# EAGLE design ZeroBug MK2 REV1 (EAGLE 7.7.0)
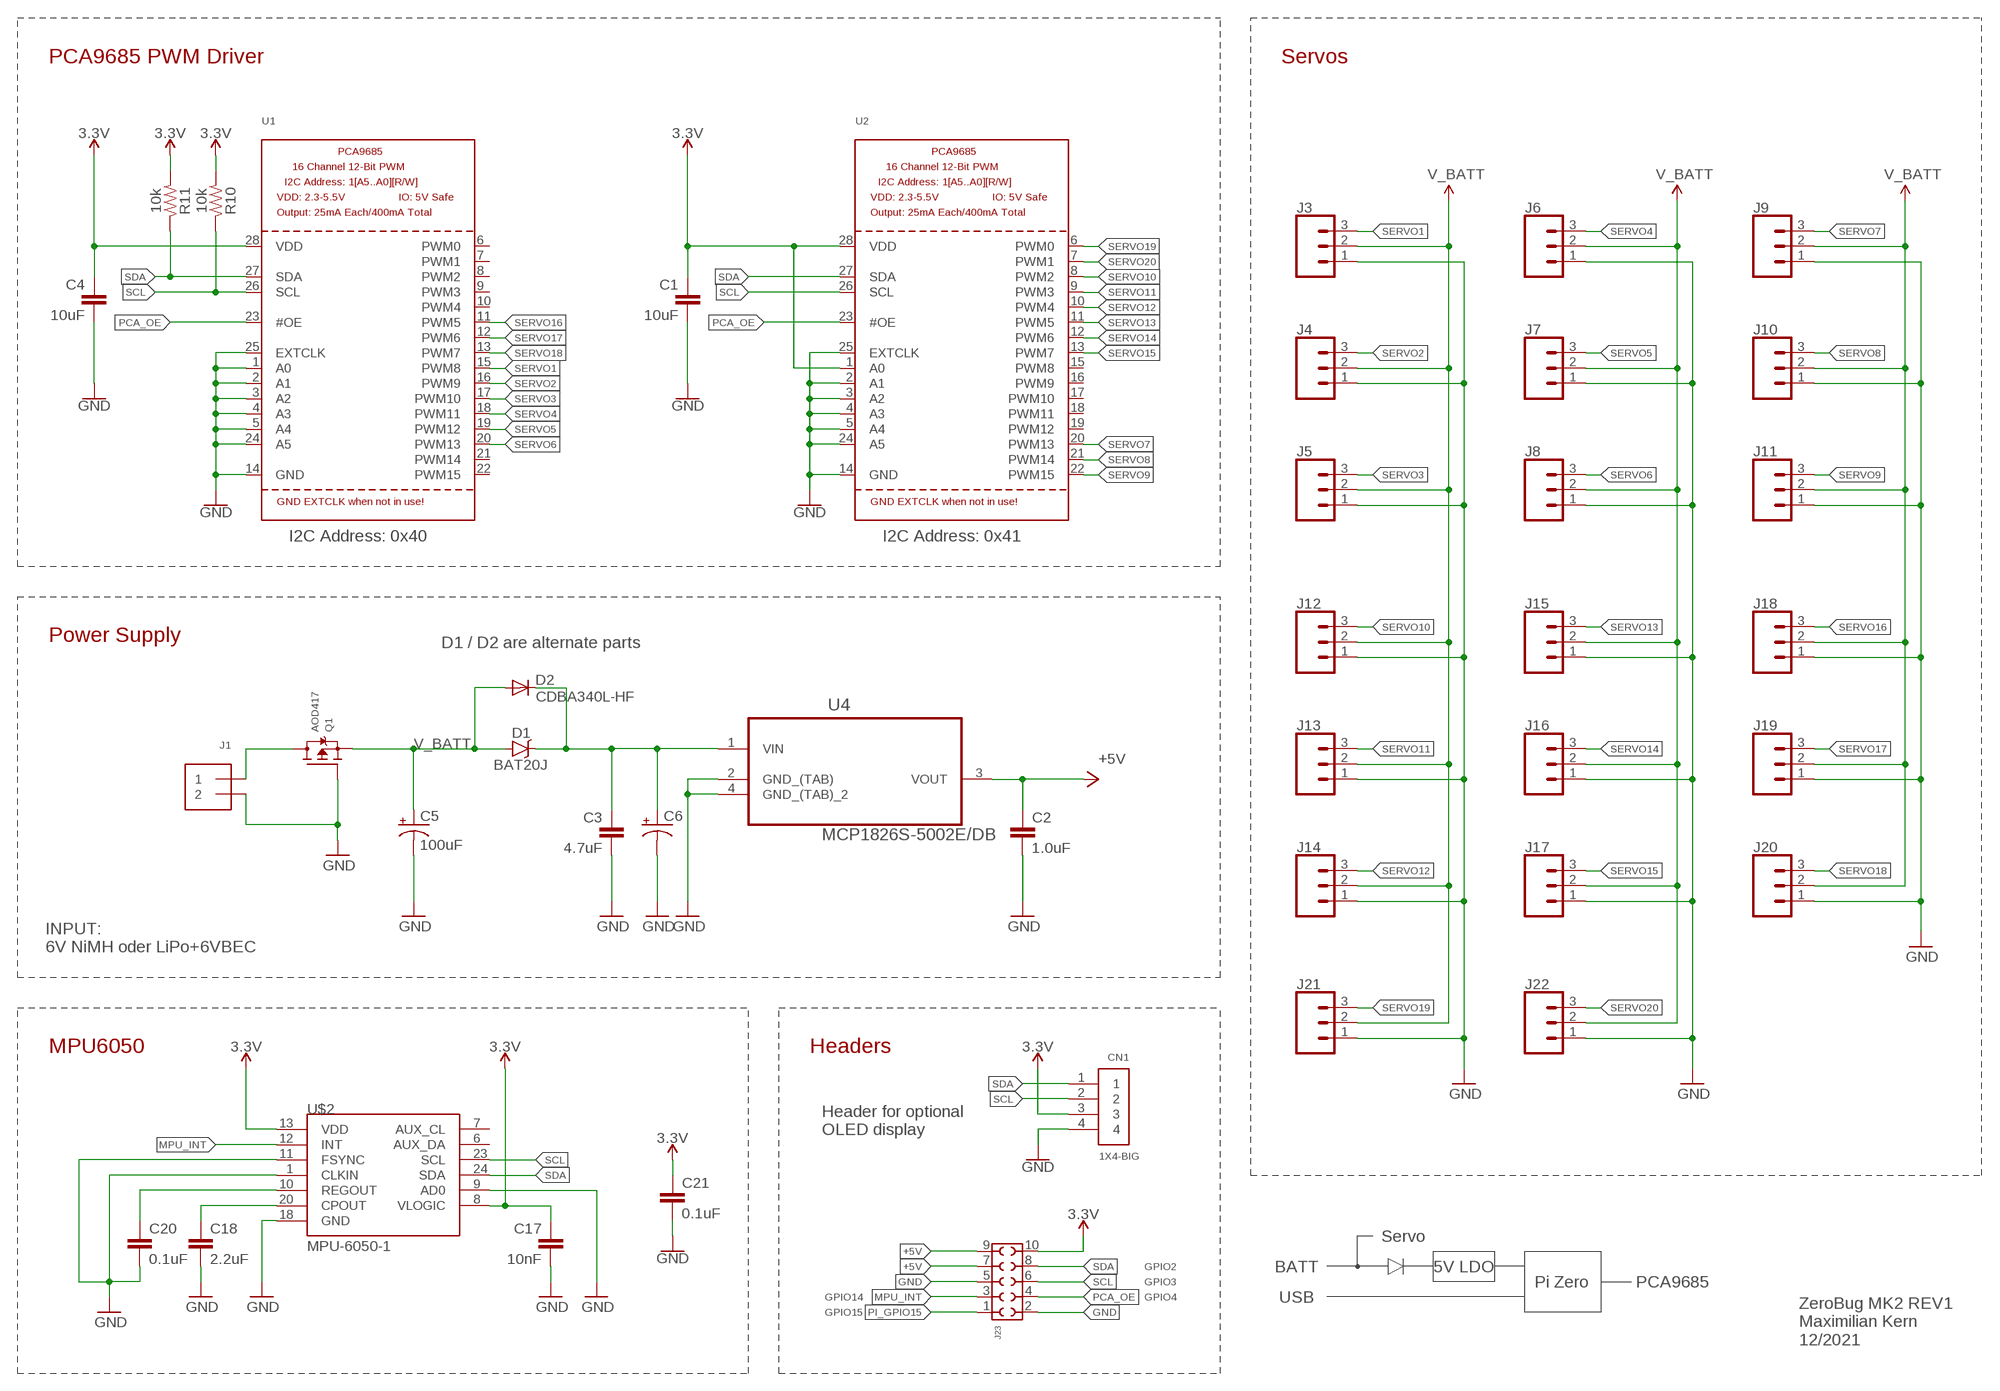
[diagram p0: schematic, sheet 1]

## Parts
C1  10uF  1.0UF-0805-25V-(+80/-20%)  [0805]
C2  1.0uF  1.0UF-0805-25V-(+80/-20%)  [0805]
C3  4.7uF  1.0UF-0805-25V-(+80/-20%)  [0805]
C4  10uF  1.0UF-0805-25V-(+80/-20%)  [0805]
C5  100uF  100UF-POLAR-25V-20%(ELEC)  [PANASONIC_D]
C6  CPOL-USE5-10.5  [E5-10,5]
C17  10nF  47PF-0603-50V-5%  [0603]
C18  2.2uF  1.0UF-0805-25V-(+80/-20%)  [0805]
C20  0.1uF  0.1UF-0603-25V-(+80/-20%)  [0603]
C21  0.1uF  0.1UF-0603-25V-(+80/-20%)  [0603]
CN1  1X4-BIG  [1X04-BIG]
D1  BAT20J  DIODE-SCHOTTKY-BAT20J  [SOD-323]
D2  CDBA340L-HF  DIODE-DO-214AC  [DO-214AC]
J1  TERMBLOCK_1X2  [TERMBLOCK_1X2-3.5MM]
J3  CONN_03  [1X03]
J4  CONN_03  [1X03]
J5  CONN_03  [1X03]
J6  CONN_03  [1X03]
J7  CONN_03  [1X03]
J8  CONN_03  [1X03]
J9  CONN_03  [1X03]
J10  CONN_03  [1X03]
J11  CONN_03  [1X03]
J12  CONN_03  [1X03]
J13  CONN_03  [1X03]
J14  CONN_03  [1X03]
J15  CONN_03  [1X03]
J16  CONN_03  [1X03]
J17  CONN_03  [1X03]
J18  CONN_03  [1X03]
J19  CONN_03  [1X03]
J20  CONN_03  [1X03]
J21  CONN_03  [1X03]
J22  CONN_03  [1X03]
J23  6103XX21821_61031021821  [61031021821]
Q1  AOD417  MOSFET-PTO252  [TO252]
R10  10k  10KOHM-0603-1/10W-1%  [0603]
R11  10k  10KOHM-0603-1/10W-1%  [0603]
U1  PCA9685  [TSSOP28]
U2  PCA9685  [TSSOP28]
U4  MCP1826S-5002E/DB  MCP1825S-5002E/DB  [SOT230P700X180-4N]
U$2  MPU-6050-1  [QFN-24-4MM2]

## Nets
3.3V: C1.1 C4.1 C17.1 C21.1 CN1.3 J23.10 R10.2 R11.2 U1.28(VDD) U2.1(A0) U2.28(VDD) U$2.8(VLOGIC) U$2.13(VDD)
+5V: C2.1 J23.7 J23.9 U4.3(VOUT)
GND: C1.2 C2.2 C3.2 C4.2 C5.- C6.- C17.2 C18.2 C20.2 C21.2 CN1.4 J1.2 J3.1 J4.1 J5.1 J6.1 J7.1 J8.1 J9.1 J10.1 J11.1 J12.1 J13.1 J14.1 J15.1 J16.1 J17.1 J18.1 J19.1 J20.1 J21.1 J22.1 J23.2 J23.5 Q1.1(G) U1.1(A0) U1.2(A1) U1.3(A2) U1.4(A3) U1.5(A4) U1.14(GND) U1.24(A5) U1.25(EXTCLK) U2.2(A1) U2.3(A2) U2.4(A3) U2.5(A4) U2.14(GND) U2.24(A5) U2.25(EXTCLK) U4.2(GND_(TAB)) U4.4(GND_(TAB)_2) U$2.1(CLKIN) U$2.9(AD0) U$2.11(FSYNC) U$2.18(GND)
MPU_INT: J23.3 U$2.12(INT)
N$4: C3.1 C6.+ D1.C D2.C U4.1(VIN)
N$6: J1.1 Q1.3(D)
N$17: C18.1 U$2.20(CPOUT)
N$18: C20.1 U$2.10(REGOUT)
PCA_OE: J23.4 U1.23(#OE) U2.23(#OE)
PI_GPIO15: J23.1
SCL: CN1.2 J23.6 R10.1 U1.26(SCL) U2.26(SCL) U$2.23(SCL)
SDA: CN1.1 J23.8 R11.1 U1.27(SDA) U2.27(SDA) U$2.24(SDA)
SERVO1: J3.3 U1.15(PWM8)
SERVO2: J4.3 U1.16(PWM9)
SERVO3: J5.3 U1.17(PWM10)
SERVO4: J6.3 U1.18(PWM11)
SERVO5: J7.3 U1.19(PWM12)
SERVO6: J8.3 U1.20(PWM13)
SERVO7: J9.3 U2.20(PWM13)
SERVO8: J10.3 U2.21(PWM14)
SERVO9: J11.3 U2.22(PWM15)
SERVO10: J12.3 U2.8(PWM2)
SERVO11: J13.3 U2.9(PWM3)
SERVO12: J14.3 U2.10(PWM4)
SERVO13: J15.3 U2.11(PWM5)
SERVO14: J16.3 U2.12(PWM6)
SERVO15: J17.3 U2.13(PWM7)
SERVO16: J18.3 U1.11(PWM5)
SERVO17: J19.3 U1.12(PWM6)
SERVO18: J20.3 U1.13(PWM7)
SERVO19: J21.3 U2.6(PWM0)
SERVO20: J22.3 U2.7(PWM1)
V_BATT: C5.+ D1.A D2.A J3.2 J4.2 J5.2 J6.2 J7.2 J8.2 J9.2 J10.2 J11.2 J12.2 J13.2 J14.2 J15.2 J16.2 J17.2 J18.2 J19.2 J20.2 J21.2 J22.2 Q1.2(S)
Unconnected: U1.6(PWM0) U1.7(PWM1) U1.8(PWM2) U1.9(PWM3) U1.10(PWM4) U1.21(PWM14) U1.22(PWM15) U2.15(PWM8) U2.16(PWM9) U2.17(PWM10) U2.18(PWM11) U2.19(PWM12) U$2.6(AUX_DA) U$2.7(AUX_CL)

## Notes on the sheet
- PCA9685 PWM Driver | Servos
- I2C Address: 0x40 | I2C Address: 0x41
- Power Supply
- D1 / D2 are alternate parts
- INPUT:
  6V NiMH oder LiPo+6VBEC
- MPU6050 | Headers
- Header for optional
  OLED display
- Servo
- GPIO2 | BATT | 5V LDO
- GPIO3 | Pi Zero | PCA9685
- GPIO14 | GPIO4 | USB
- ZeroBug MK2 REV1
  Maximilian Kern
  12/2021
- GPIO15

## Library data of the parts
C1 C3 C4 C18 = SparkFun-Capacitors:1.0UF: 1µF ceramic capacitors A capacitor is a passive two-terminal electrical component used to store electrical energy temporarily in an electric field.; PROD_ID: CAP-11625; VALUE: 1.0uF
C2 = SparkFun-Capacitors:1.0UF: 1µF ceramic capacitors A capacitor is a passive two-terminal electrical component used to store electrical energy temporarily in an electric field.; PROD_ID: CAP-11625
C5 = SparkFun-Capacitors:100UF-POLAR: 100µF polarized capacitors A capacitor is a passive two-terminal electrical component used to store electrical energy temporarily in an electric field.; PROD_ID: CAP-12547
C6 = adafruit:CPOL-US: POLARIZED CAPACITOR, American symbol
C17 = SparkFun-Capacitors:47PF: 47pF ceramic capacitors A capacitor is a passive two-terminal electrical component used to store electrical energy temporarily in an electric field.; PROD_ID: CAP-08913; VALUE: 47pF
C20 C21 = SparkFun-Capacitors:0.1UF: 0.1µF ceramic capacitors A capacitor is a passive two-terminal electrical component used to store electrical energy temporarily in an electric field.; PROD_ID: CAP-00810
CN1 = adafruit:1X4: 4-pin connector
D1 = SparkFun-DiscreteSemi:DIODE-SCHOTTKY: Schottky diodes in SFE's production catalog BAT20J 1A 23V 0.62Vf RB751 120mA 40V 0.37Vf PMEG4005EJ 0.5A 40V 0.42Vf MBRA140 1A 40V 0.5Vf B340A 3A 40V SMA; PROD_ID: DIO-11623
D2 = diode:DIODE-: DIODE
J1 = microbuilder:TERMBLOCK_1X2: 3.5mm Terminal block http://www.ladyada.net/library/pcb/eaglelibrary.html
J3-J22 = SparkFun-Connectors:CONN_03: Multi connection point. Often used as Generic Header-pin footprint for 0.1 inch spaced/style header connections On any of the 0.1 inch spaced packages, you can populate with these: Break Away Headers - Straight <https://www.sparkfun.com/products/116> (PRT-00116) Break Away Male Headers - Right Angle <https://www.sparkfun.com/products/553> (PRT-00553) Female Headers <https://www.sparkfun.com/products/115> (PRT-00115) Break Away Headers - Machine Pin <https://www.sparkfun.com/products/117> (PRT-00117) Break Away Female Headers - Swiss Machine Pin <https://www.sparkfun.com/products/743> (PRT-00743) Stackable Header - 3 Pin (Female, 0.1") <https://www.sparkfun.com/products/13875> (PRT-13875) For SCREWTERMINALS and SPRING TERMINALS visit here: Screw Terimnals on SparkFun.com <https://www.sparkfun.com/search/results?term=Screw+Terminals> (5mm/3.5mm/2.54mm spacing) This device is also useful as a general connection point to wire up your design to another part of your project. Our various solder wires solder well into these plated through hole pads. Hook-Up Wire - Assortment (Stranded, 22 AWG) <https://www.sparkfun.com/products/11375> (PRT-11375) Hook-Up Wire - Assortment (Solid Core, 22 AWG) <https://www.sparkfun.com/products/11367> (PRT-11367) View the entire wire category on our website here <https://www.sparkfun.com/categories/141> Special notes: Molex polarized connector foot print use with SKU : PRT-08232 with associated crimp pins and housings.; PROD_ID: XXX-00000; VALUE: 455-1750-1-ND
J23 = Eagle_WR-PHD (rev19a):6103XX21821_61031021821: WR-PHD 2.54 mm SMT Dual Socket Header (Reel) ARTICLE PROPERTIES Pins ： 4;​ 6;​ 8;​ 10;​ 12;​ 14;​ 16;​ 18;​ 20;​ 22;​ 24;​ 26 KIND PROPERTIES Pitch 2.54 mm Quality Class 3 as per CECC 75 301-802 Rows Dual Gender Socket Header Type Straight Type 2 MATERIAL PROPERTIES Insulator Material PA46 Insulator Flammability Rating UL94 V-0 Contact Material Copper Alloy Contact Plating Gold Contact Type Stamped GENERAL INFORMATION Operating Temperature -40 up to +105 °C ELECTRICAL PROPERTIES Rated Current 3 A IR1 = 3A Withstanding Voltage 600 V (AC) Contact Resistance 20 mΩ RISO 1000 MΩ CERTIFICATION UL Approval E323964 PACKAGING PROPERTIES Packaging Tape and Reel with Cap <https://katalog.we-online.com/media/images/v2/o33206v209%20Family_WR-PHD_610xxx21821.jpg> Details see: https://katalog.we-online.com/en/em/PHD_2_54_SMT_DUAL_SOCKET_HEADER_REEL_6103XX21821 Updated by Ella Wu 2019-06-12 2019 (C) Würth Elektronik; DATASHEET-URL: https://katalog.we-online.com/em/datasheet/61031021821.pdf; GENDER: Socket Header; IR: 3A; PACKAGING: Tape and Reel with Cap; PART-NUMBER: 61031021821; PINS: 10; ROWS: Dual; TYPE: Straight Type 2; WE-NUMBER: 61031021821
Q1 = microbuilder:MOSFET-P: P-Channel Mosfet LEGEND VDS: Voltage Drain-Source ID: Drain Current RDS(ON): Drain-Source On-State Resistance VGS(TH): Gate-Source Threshold Voltage CISS: Drain-Source Input Capacitance SOT-23 Name VDS ID RDS(ON) VGS(TH) CISS Order Number IRLML5103 30V 760mA 600 mOhm -- 75pF @ 25V Digikey: IRLML5103PBFCT-ND IRLML6401 12V 4.3A 50 mOhm 950mV @ 250µA 830pF @ 10V Digikey: IRLML6401PBFTR-ND NTR0202PL 20V 400mA 800 mOhm 2.3V @ 250uA 70pF @ 5V Digikey: NTR0202PLT1GOSTR-ND NTR4101PT1G 20V 1.8A 85 mOhm 1.2V @ 250uA 675pF @ 10V Digikey: NTR4101PT1GOSCT-ND DMP2004K 20V 600mA 900 mOhm 1V @ 250uA 175pF @ 16V Digikey: DMP2004KDICT-ND PMV65XP 20V 3.9A 76 mOhm 950mV @ 1mA 725pF @ 20V Digikey: 568-2358-2-ND TO-252 Name VDS ID RDS(ON) VGS(TH) CISS Order Number AOD417 30V 25A 34 mOhm 3V @ 250µA 920pF @ 15V Digikey: 785-1106-2-ND
R10 R11 = SparkFun-Resistors:10KOHM: 10kΩ resistor A resistor is a passive two-terminal electrical component that implements electrical resistance as a circuit element. Resistors act to reduce current flow, and, at the same time, act to lower voltage levels within circuits. - Wikipedia; PROD_ID: RES-00824
U1 U2 = adafruit:PCA9685: PCA9685 - 16 Channel 12-Bit I2C PWM Controller 5.0V tolerant 16 channel, 12-bit I2C PWM controller with 25mA per output (max. 400mA total) Digikey: 568-5931-1-ND
U4 = Microchip_By_element14_Batch_1:MCP1825S-5002E/DB: IC, LDO, 5.0V, 500MA; MPN: MCP1825S-5002E/DB; OC_FARNELL: 1578407; OC_NEWARK: 26M9964; PACKAGE: SOT-223-3; SUPPLIER: Microchip
U$2 = MPU-6050 hand solder:MPU-6050

## Board
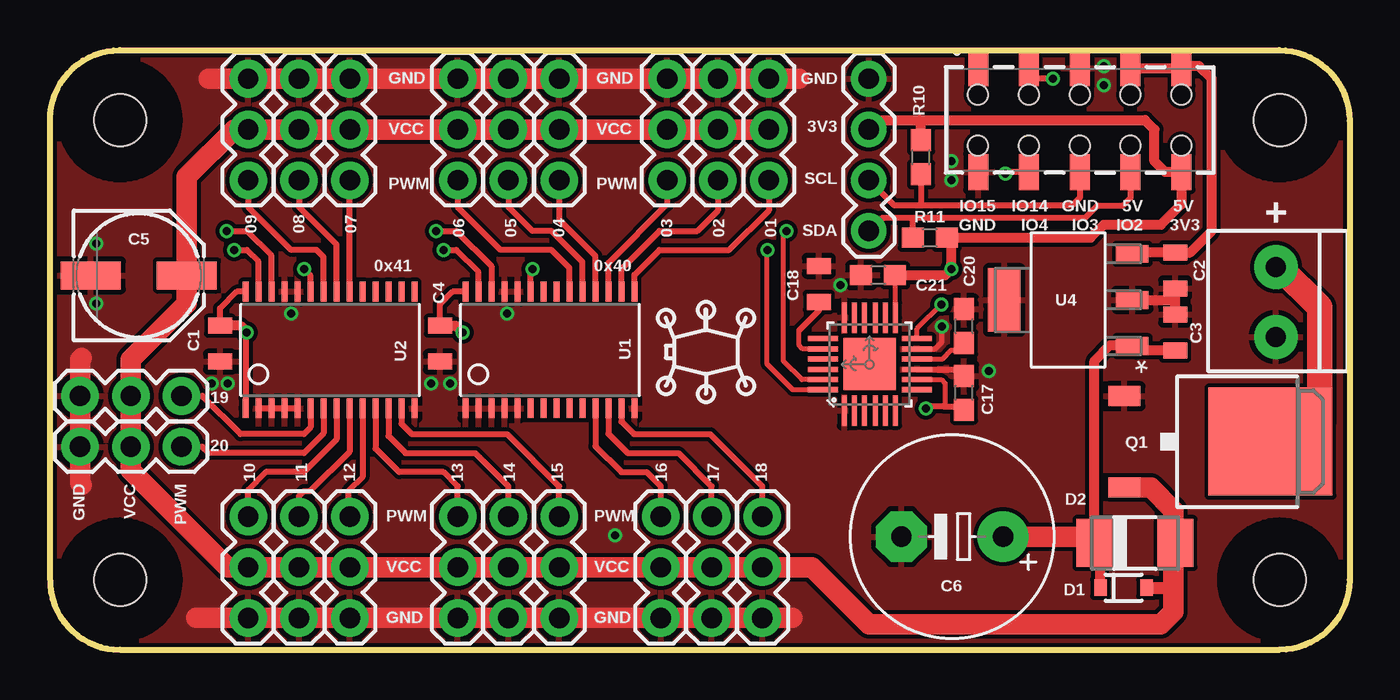
[diagram p1: board, top side]
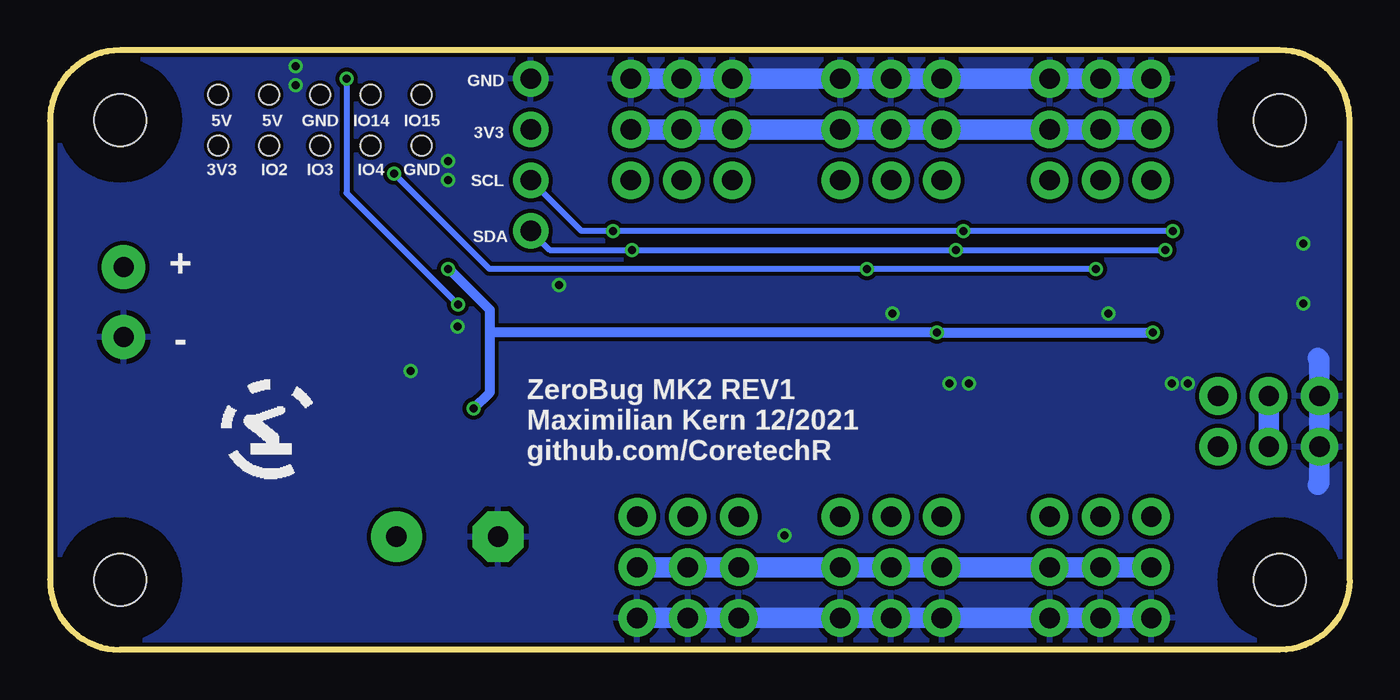
[diagram p2: board, bottom side, seen from below]

Size 65 x 30 mm. Coordinates in mm from the lower left corner, seen from the top.
Outline: 0,3.5 0,26.5 arc-90 3.5,30 61.46,30 arc-90 65,26.46 65,3.5 arc-90 61.5,0 3.5,0 arc-90 0,3.5
Copper layers (1*16): Top 0.035mm / dielectric 1.5mm / Bottom 0.035mm
Design rules "aisler_2_layer *": minimum track width 0.2mm, minimum drill 0.2mm, track to track 0.2mm, track to pad 0.2mm, pad to pad 0.2mm, via to via 0.2mm, smd to smd 0.1mm, copper to edge 0.2mm, drill to drill 0.21mm, minimum pad ring 0.25mm, minimum via ring 0.15mm, stop-mask expansion 2.5mil, vias tented up to drill 43mil, thermal gap 10mil
Holes 2.6 mm at 61.5,26.5 3.5,26.5 3.5,3.5 61.5,3.5
Holes 1 mm at 46.42,27.77 48.96,27.77 51.5,27.77 54.04,27.77 56.58,27.77 56.58,25.23 54.04,25.23 51.5,25.23 48.96,25.23 46.42,25.23

### Footprints (pad centres in the part's own frame; a part is rotated, then mirrored left to right if it is on the bottom)
0805 = smd 0.8 x 1.2: 1 -0.9,0; 2 0.9,0
PANASONIC_D = smd 3 x 1.4: + 2.4,0; - -2.4,0
E5-10,5 = drill 1.016 pad 2.54: + -2.54,0 | drill 1.016 pad 2.54 octagon: - 2.54,0
0603 = smd 1.1 x 1: 1 -0.85,0; 2 0.85,0
1X04-BIG = drill 1.016 pad 1.778: 1 0,0; 2 2.54,0; 3 5.08,0; 4 7.62,0
SOD-323 = smd 0.63 x 0.83: A 1.15,0; C -1.15,0
DO-214AC = smd 1.8 x 2.4: A 2.025,0; C -2.025,0
TERMBLOCK_1X2-3.5MM = drill 1 pad 2.184: 1 1.8,0; 2 -1.7,0
1X03 = drill 1.016 pad 1.88: 1 0,0; 2 2.54,0; 3 5.08,0
61031021821 = smd 1 x 1.8: 1 -5.08,2.6; 2 -5.08,-2.6; 3 -2.54,2.6; 4 -2.54,-2.6; 5 0,2.6; 6 0,-2.6; 7 2.54,2.6; 8 2.54,-2.6; 9 5.08,2.6; 10 5.08,-2.6
TO252 = smd 1 x 1.6: 1 -2.28,-4.8; 2 2.28,-4.8 | smd 5.4 x 6.2: 3 0,2.5
TSSOP28 = smd 0.305 x 0.991: 1 -4.225,-2.918; 2 -3.575,-2.918; 3 -2.925,-2.918; 4 -2.275,-2.918; 5 -1.625,-2.918; 6 -0.975,-2.918; 7 -0.325,-2.918; 8 0.325,-2.918; 9 0.975,-2.918; 10 1.625,-2.918; 11 2.275,-2.918; 12 2.925,-2.918; 13 3.575,-2.918; 14 4.225,-2.918; 15 4.225,2.918; 16 3.575,2.918; 17 2.925,2.918; 18 2.275,2.918; 19 1.625,2.918; 20 0.975,2.918; 21 0.325,2.918; 22 -0.325,2.918; 23 -0.975,2.918; 24 -1.625,2.918; 25 -2.275,2.918; 26 -2.925,2.918; 27 -3.575,2.918; 28 -4.225,2.918
SOT230P700X180-4N = smd 1.626 x 0.889: 1 -3.2,2.311; 2 -3.2,0; 3 -3.2,-2.311 | smd 1.626 x 3.175: 4 3.2,0
QFN-24-4MM2 = smd 1.516 x 0.254: 1 -2.316,1.257; 2 -2.316,0.75; 3 -2.316,0.247; 4 -2.316,-0.287; 5 -2.316,-0.792; 6 -2.316,-1.297; 13 2.336,-1.297; 14 2.336,-0.792; 15 2.336,-0.287; 16 2.336,0.247; 17 2.336,0.75; 18 2.336,1.257 | smd 0.254 x 1.516: 7 -1.267,-2.372; 8 -0.762,-2.372; 9 -0.258,-2.372; 10 0.278,-2.372; 11 0.78,-2.372; 12 1.287,-2.372; 19 1.287,2.332; 20 0.78,2.332; 21 0.278,2.332; 22 -0.258,2.332; 23 -0.762,2.332; 24 -1.267,2.332 | smd 2.616 x 2.616: P$1 0.02,-0.01

### Placement (x,y rotation side)
C1  8.51,15.32 270 top
C2  56.28,18.98 270 top
C3  56.28,15.86 90 top
C4  19.51,15.32 270 top
C5  4.45,18.73 0 top
C6  45.13,5.66 180 top
C17  45.72,12.86 90 top
C18  38.45,18.31 90 top
C20  45.72,16.19 90 top
C21  41.42,18.74 180 top
CN1  40.96,20.95 90 top
D1  53.7,3.11 0 top
D2  54.26,5.34 0 top
J1  61.32,17.35 90 top
J3  35.95,28.57 270 top
J4  33.41,28.57 270 top
J5  30.87,28.57 270 top
J6  25.47,28.57 270 top
J7  22.93,28.57 270 top
J8  20.39,28.57 270 top
J9  14.99,28.57 270 top
J10  12.46,28.57 270 top
J11  9.91,28.57 270 top
J12  9.91,1.59 90 top
J13  12.46,1.59 90 top
J14  14.99,1.59 90 top
J15  20.39,1.59 90 top
J16  22.93,1.59 90 top
J17  25.47,1.59 90 top
J18  30.55,1.59 90 top
J19  33.09,1.59 90 top
J20  35.63,1.59 90 top
J21  1.5,12.7 0 top
J22  1.5,10.16 0 top
J23  51.51,26.51 0 top
Q1  58.55,10.41 270 top
R10  43.56,24.64 90 top
R11  44.01,20.61 0 top
U1  25.01,15 0 top
U2  14.01,15 0 top
U4  50.93,17.5 180 top
U$2  40.99,14.28 90 top

### Tracks (layer width: path | path; a pad name or v marks a point on that pad's centre or on a via)
3.3V  (via drill 0.4)
  Top 0.25: U$2.8 44.59,13.52 44.77,13.34 44.77,12.13 44.73,12.17 | U$2.13 42.29,18.72 C21.1
  Top 0.3: v43.81,12.06 43.92,12.17 44.73,12.17 45.56,12.17 C17.1 | 9.78,15.94 v9.84,15.88 9.78,15.81 U2.1 | U1.28 20.14,17.92 19.51,17.29 C4.1 | C1.1 8.51,17.08 9.35,17.92 U2.28 | 43.56,26.45 43.5,26.51
  Top 0.5: v9.84,15.88 9.5,16.22 C1.1 | C4.1 20.3,16.22 v20.64,15.88 | CN1.3 41.43,26.51 43.5,26.51 54.77,26.51 55.24,26.04 55.24,24.45 55.78,23.91 J23.10 56.59,22.3 55.56,21.27 52.7,21.27 52.05,20.61 R11.2 45.09,20.38 v45.09,19.05 44.78,18.74 C21.1 | R10.2 43.56,26.45
  Bottom 0.5: v9.84,15.88 v20.64,15.88 42.96,15.88 43,15.83 | v43.81,12.06 43,12.88 43,15.83 | 43,15.83 43,17 45.05,19.05 v45.09,19.05
+5V
  Top 0.3: 54.2,19.88 U4.3
  Top 0.5: 54.2,19.88 C2.1 57.03,19.88 58.1,20.95 58.1,28.57 57.47,29.21 56.69,29.21 J23.9 J23.7
GND  (via drill 0.4)
  Top 0.25: U$2.11 44.27,15.06 44.61,15.4 v44.61,16.16 v44.61,16.17
  Top 0.3: 56.24,17.5 56.28,17.46 | U2.5 U2.4 U2.3 U2.2 | U$2.9 45.41,14.02 C17.2
  Top 0.5: C3.2 56.28,17.46 C2.2 | U4.2 56.24,17.5
  Top 1.016: 7.3,1.59 J13.1 37.15,1.59 | 37.47,28.57 J11.1 7.94,28.57 | 1.59,14.61 1.5,14.52 J21.1 1.5,8.34 1.59,8.26
  Bottom 1.016: J12.1 35.88,1.59 | J11.1 35.88,28.57 | 1.59,14.61 1.5,14.52 J21.1 1.5,8.34 1.59,8.26
  other vias: 8.89,13.34 8.1,13.34 20,13.34 19.05,13.34 12.06,16.83 22.86,16.83 45.09,23.5 45.09,24.45 52.7,29.21 52.7,28.26 2.31,20.33 2.31,17.33 46.95,13.96 39.53,18.26 28.26,5.71
  pour Top: 0,30 0,0 65,0 65,30
  pour Bottom: 0,30 0,0 65,0 65,30
MPU_INT  (via drill 0.4)
  Top 0.25: v44.59,17.28 43.37,16.06 U$2.12
  Top 0.3: v50.16,28.57 49.08,28.57 49,28.5 49,29.08 J23.3
  Bottom 0.305: v50.16,28.57 50.16,22.86 v44.59,17.28
N$1
  cutout Bottom: 64.5,26.5 arc-90 61.5,23.5 arc-90 58.5,26.5 arc-90 61.5,29.5 arc-90
  cutout Bottom: 64.5,3.5 arc-90 61.5,0.5 arc-90 58.5,3.5 arc-90 61.5,6.5 arc-90
  cutout Bottom: 6.5,3.5 arc-90 3.5,0.5 arc-90 0.5,3.5 arc-90 3.5,6.5 arc-90
  cutout Bottom: 6.5,26.5 arc-90 3.5,23.5 arc-90 0.5,26.5 arc-90 3.5,29.5 arc-90
  cutout Top: 6.5,26.5 arc-90 3.5,23.5 arc-90 0.5,26.5 arc-90 3.5,29.5 arc-90
  cutout Top: 6.5,3.5 arc-90 3.5,0.5 arc-90 0.5,3.5 arc-90 3.5,6.5 arc-90
  cutout Top: 64.5,26.5 arc-90 61.5,23.5 arc-90 58.5,26.5 arc-90 61.5,29.5 arc-90
  cutout Top: 64.5,3.5 arc-90 61.5,0.5 arc-90 58.5,3.5 arc-90 61.5,6.5 arc-90
N$4
  Top 0.25: 51.8,5.66 51.92,5.66 D2.C
  Top 0.3: 54.36,14.96 U4.1 54.08,15.24
  Top 0.406: 52.55,5.03 D2.C
  Top 0.5: D1.C 52.55,5.03 | C3.1 54.36,14.96 | D2.C 52.24,14.46 53.02,15.24 54.08,15.24
  Top 1.016: 51.8,5.66 C6.+
N$6
  Top 1.27: J1.1 61.49,19.15 63.5,17.14 63.5,11.43 61.59,9.53 61.59,9.87 Q1.3
N$17
  Top 0.25: U$2.20 37.65,15.06 37.47,15.24 37.47,15.98
  Top 0.3: C18.1 38.45,16.97 37.47,15.98
N$18
  Top 0.25: U$2.10 44.65,14.55 45.09,14.99 45.37,14.99 C20.1 | 45.5,15 45.49,14.99 45.49,15.11 C20.1 | 45.62,15.24 C20.1
PCA_OE  (via drill 0.4)
  Top 0.3: J23.4 47.88,23.91 v47.78,23.81 | U1.23 24.03,18.95 v24.13,19.05 | U2.23 13.03,18.72 v12.7,19.05
  Bottom 0.3: v12.7,19.05 v24.13,19.05 43.02,19.05 v47.78,23.81
SCL  (via drill 0.4)
  Top 0.25: v36.83,20.95 36.69,20.82 36.69,14.43 37.6,13.52 U$2.23
  Top 0.3: J23.6 51.51,22.61 51.12,22.23 43.5,22.23 | U2.26 11.08,19.71 9.84,20.95 v8.84,20.95 | U1.26 22.08,19.19 20.32,20.95 v19.32,20.95 | 43.5,22.23 42.23,22.23 CN1.2 | R10.1 43.56,22.29 43.5,22.23
  Bottom 0.3: v8.84,20.95 v19.32,20.95 v36.83,20.95 38.42,20.95 CN1.2
SDA  (via drill 0.4)
  Top 0.25: v35.88,20 v35.87,20 35.87,14.29 37.15,13.01 U$2.24
  Top 0.3: 43.18,21.59 51.75,21.59 52.39,22.23 53.66,22.23 54.05,22.61 J23.8 | 43.18,21.59 41.59,21.59 CN1.1 | v19.68,20 20.32,20 21.43,18.89 U1.27 | v9.21,20 9.84,20 10.43,19.41 U2.27 | R11.1 43.16,21.57 43.18,21.59
  Bottom 0.3: CN1.1 40.01,20 v35.88,20 v19.68,20 v9.21,20
SERVO1
  Top 0.3: U1.15 29.23,18.75 30.48,20 33.97,20 35.95,21.98 J3.3
SERVO2
  Top 0.3: U1.16 28.58,19.06 30.48,20.95 32.38,20.95 33.41,21.98 J4.3
SERVO3
  Top 0.3: U1.17 27.93,19.36 30.87,22.3 J5.3
SERVO4
  Top 0.3: U1.18 27.28,19.71 25.47,21.52 J6.3
SERVO5
  Top 0.3: U1.19 26.63,19.41 25.08,20.95 24.13,20.95 22.93,22.15 J7.3
SERVO6
  Top 0.3: U1.20 25.98,19.1 25.08,20 22.54,20 20.39,22.15 J8.3
SERVO7
  Top 0.3: U2.20 J9.3
SERVO8
  Top 0.3: U2.21 14.33,20.27 12.46,22.15 J10.3
SERVO9
  Top 0.3: U2.22 13.68,19.66 13.34,20 12.06,20 9.91,22.15 J11.3
SERVO10
  Top 0.3: U2.8 14.33,10.52 12.7,8.89 10.79,8.89 9.91,8.01 J12.3
SERVO11
  Top 0.3: J13.3 12.46,7.69 12.7,7.94 13.02,7.94 14.98,9.9 U2.9
SERVO12
  Top 0.3: U2.10 15.63,8.65 14.92,7.94 14.92,6.74 J14.3
SERVO13
  Top 0.3: U2.11 16.28,10.07 17.46,8.89 19.68,8.89 20.39,8.18 J15.3
SERVO14
  Top 0.3: U2.12 16.93,10.69 17.78,9.84 21.27,9.84 22.93,8.18 J16.3
SERVO15
  Top 0.3: U2.13 17.58,11.31 18.1,10.79 22.86,10.79 25.47,8.18 J17.3
SERVO16
  Top 0.3: U1.11 27.28,10.18 28.57,8.89 29.84,8.89 30.55,8.18 J18.3
SERVO17
  Top 0.3: U1.12 27.93,10.8 28.89,9.84 31.43,9.84 33.09,8.18 J19.3
SERVO18
  Top 0.3: U1.13 28.58,11.42 29.21,10.79 33.02,10.79 35.63,8.18 J20.3
SERVO19
  Top 0.3: U2.6 13.03,11.13 12.7,10.79 9.53,10.79 7.62,12.7 J21.3
SERVO20
  Top 0.3: U2.7 13.68,10.82 12.7,9.84 7.94,9.84 7.62,10.16 J22.3
V_BATT
  Top 0.406: 56.13,3.11 56.2,3.17
  Top 0.61: D1.A 56.13,3.11
  Top 1.016: Q1.2 55.05,8.13 56.2,6.99 56.2,5.43 D2.A 56.2,5.25 56.2,3.17 56.2,1.91 55.56,1.27 40.96,1.27 38.1,4.13 J20.2 J19.2 J18.2 J17.2 J16.2 J15.2 J14.2 J13.2 J12.2 8.89,4.13 4.04,8.98 J22.2 J21.2 4.04,14.52 6.84,17.32 C5.+ 6.84,23.67 9.21,26.04 J11.2 J10.2 J9.2 J8.2 J7.2 J6.2 J5.2 J4.2 J3.2
  Bottom 1.016: J12.2 J20.2 | J21.2 J22.2 | J11.2 J3.2

### Text on the board
tNames: GND | GND | GND | VCC | VCC | 3V3 | SCL | PWM | PWM | 09 | 08 | 07 | 06 | 05 | 04 | 03 | 02 | 01 | IO15 | IO14 | GND | 5V | 5V | + | SDA | GND | IO4 | IO3 | IO2 | 3V3 | 0x41 | 0x40 | 19 | 20 | GND | VCC | PWM | 10 | 11 | 12 | 13 | 14 | 15 | 16 | 17 | 18 | PWM | PWM | VCC | VCC | GND | GND
bNames: GND | 3V3 | IO15 | IO14 | GND | 5V | 5V | GND | IO4 | IO3 | IO2 | 3V3 | SCL | SDA | + | - | ZeroBug MK2 REV1 / Maximilian Kern 12/2021 / github.com/CoretechR